# EasyEDA Pro project 机械臂需求板.eprj

# Schematic Schematic1
Create Date: 2025-04-24; Page Name: P1; Project Name: 机械臂需求板; Schematic Name: Schematic1; Update Date: 2025-04-24; Company: 嘉立创EDA; Page Size: A4; Version: V1.0
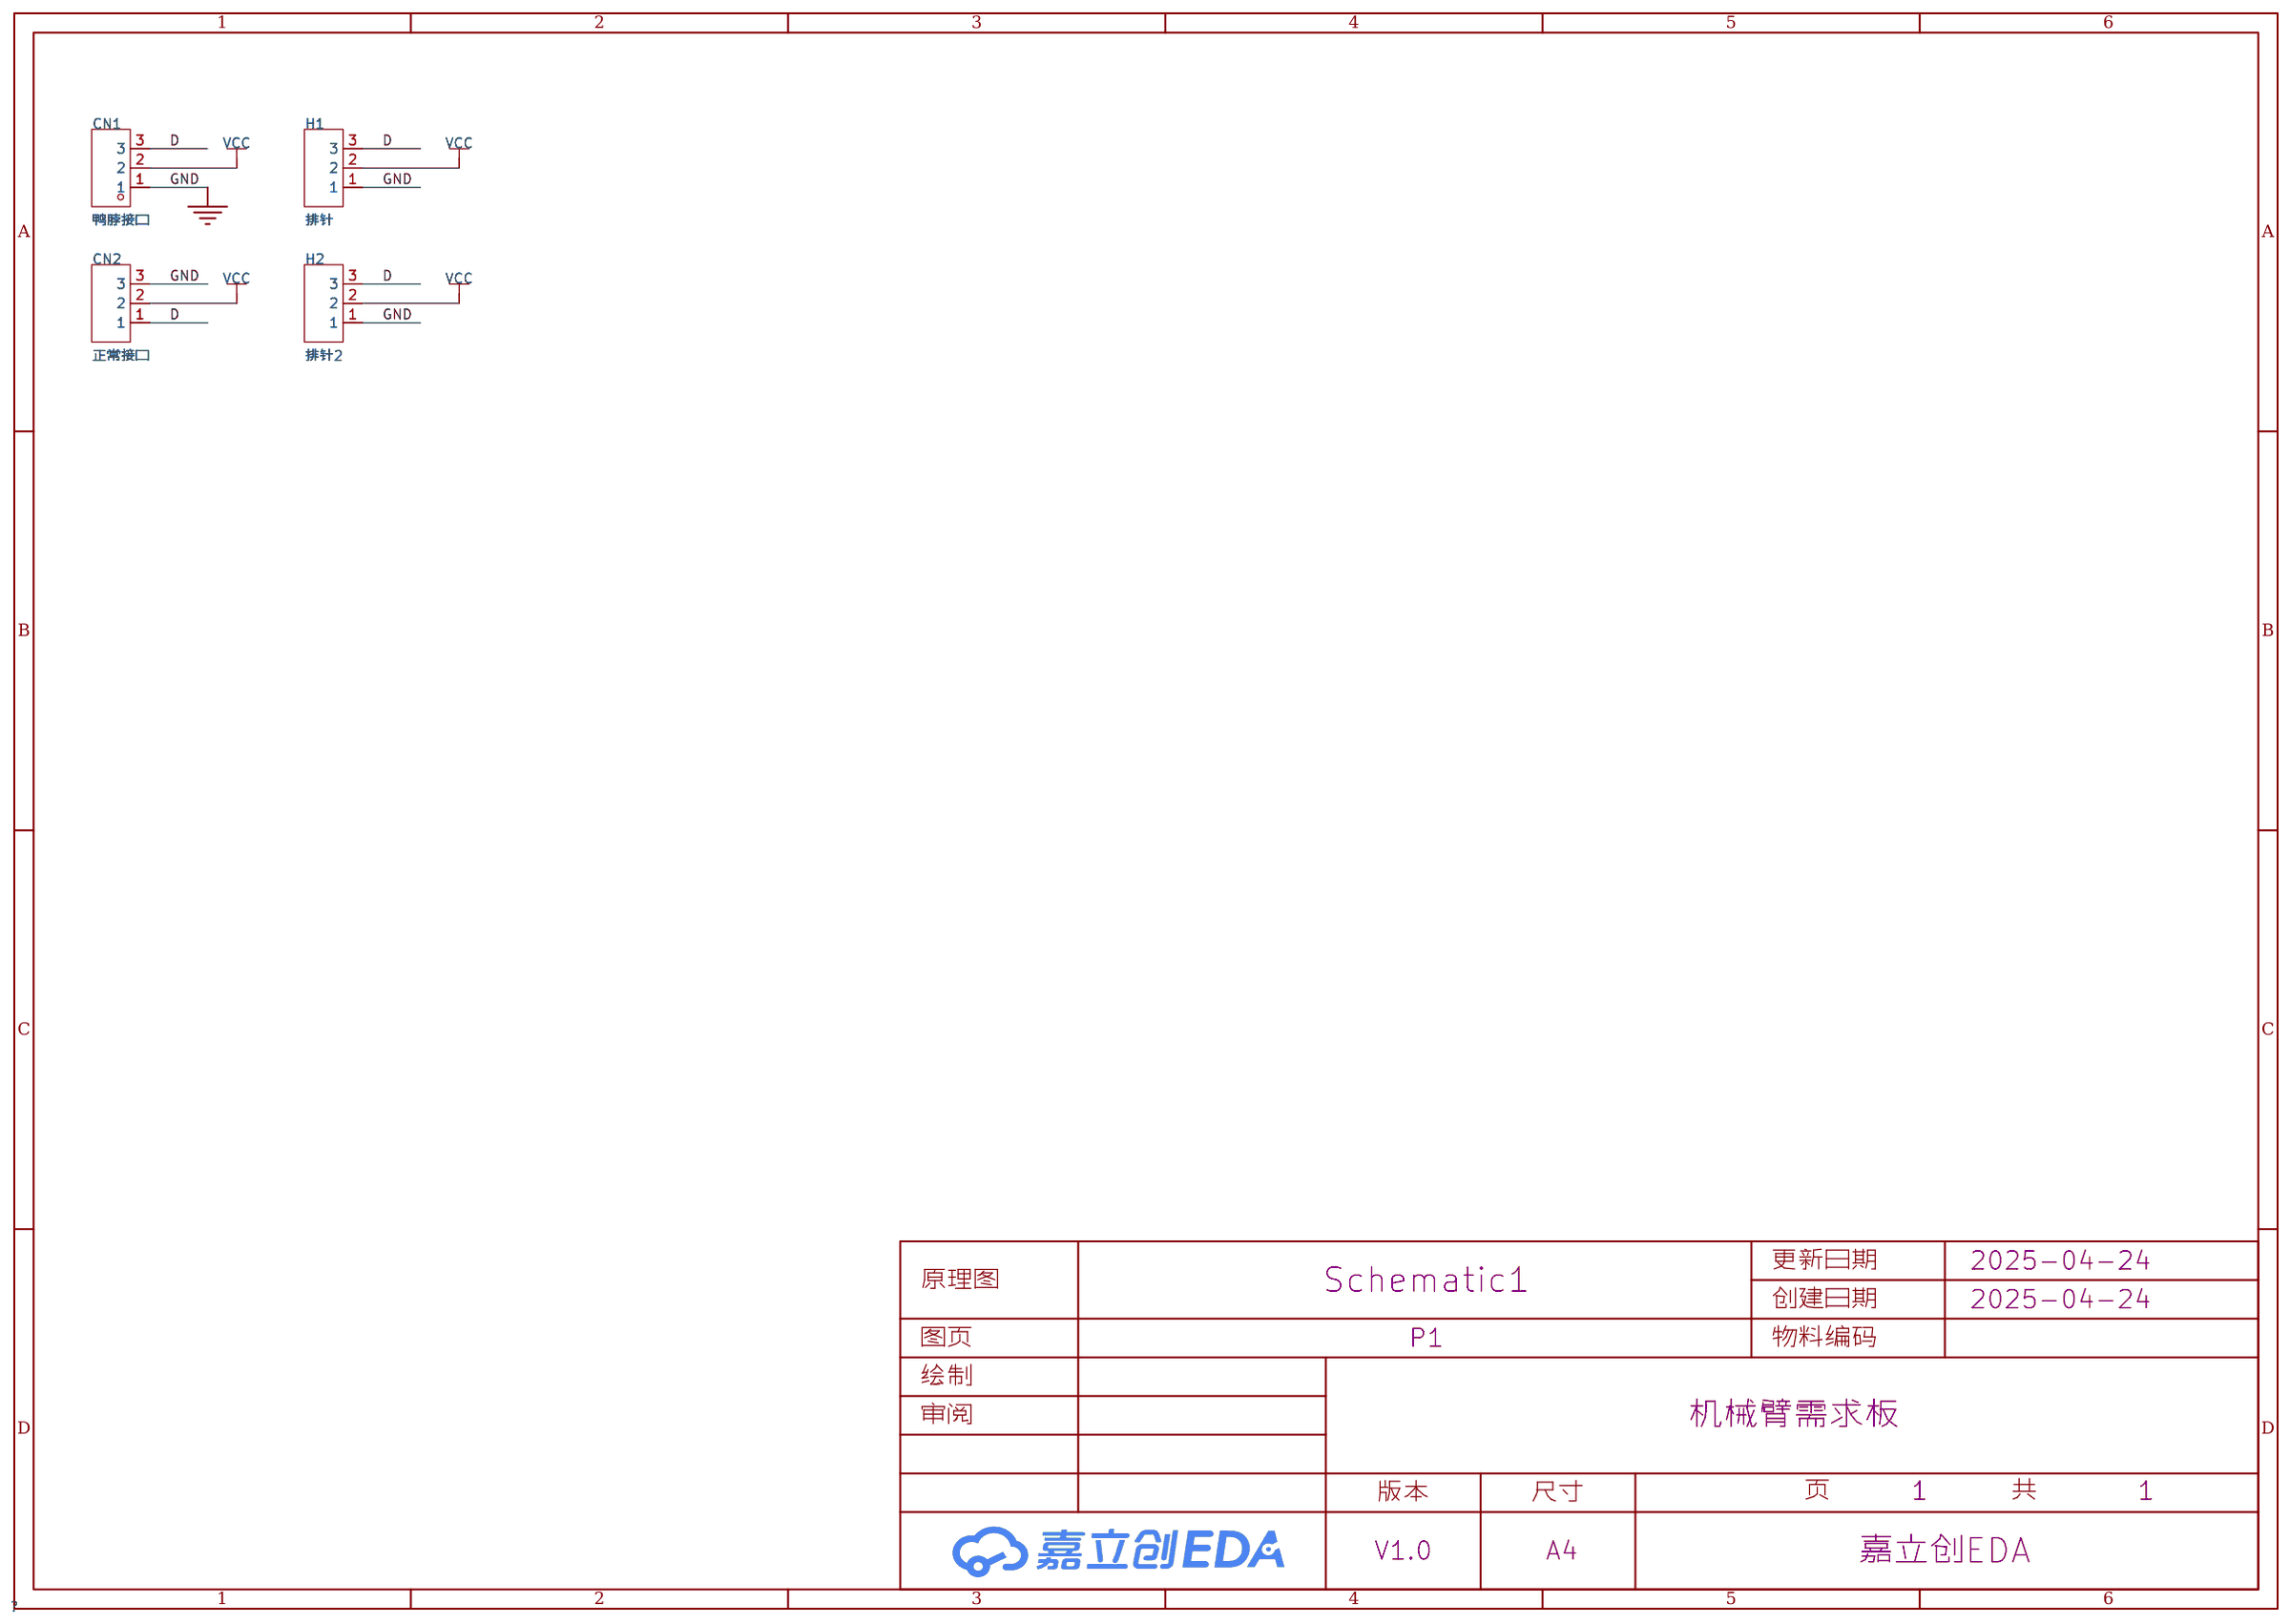
[diagram p0: schematic sheet]

## Parts
CN1  鸭脖接口  [CONN-TH_PH2.0D-L-3P]
CN2  正常接口  [CONN-TH_5264-3A]
H1  排针  [HDR-TH_3P-P2.54-V-M]
H2  排针2  [HDR-TH_3P-P2.54-V-M]

## Library data of the parts
CN1 = WAFER-PH2.0-3PZZ: 插针结构:1x3P;间距:2mm;安装方式:直插;参考系列:PH;总PIN数:3P;排数:1;每排PIN数:3;行距:-;额定电流:2A;触头材质:黄铜;触头镀层:锡;工作温度:-25℃~+85℃;; LCSC Part Name: 1x3P 间距:2mm 直插 系列:PH; Supplier Part: C5359600; Manufacturer: XUNPU(讯普); Supplier Footprint: 插件,P=2mm; JLCPCB Part Class: 扩展库; Datasheet: https://atta.szlcsc.com/upload/public/pdf/source/20241108/09B74E94153224768C62B7F095CB8C18.pdf; Supplier: LCSC; Pins Structure: 1x3P; Pitch: 2mm; Mounting Type: 直插; Reference Series: PH; Number of Pins: 3P; Number of Rows: 1; Number of PINs Per Row: 3; Current Rating: 2A; Contact Material: 黄铜; Contact Plating: 锡; Operating Temperature: -25℃~+85℃; Voltage Rating: 250V; Plastic Material: PA66; Flame Retardant Rating: UL94V-0; Color: 白色; Z-Height of the Board: 6.05mm; X-Length of Bottom Edge on Board (Spacing Line): 8mm; Y-Width of Bottom Edge on Board: 4.7mm
CN2 = 5264-3A: 插针结构:1x3P;间距:2.5mm;安装方式:直插;参考系列:Mini-SPOX(5264);总PIN数:3P;排数:1;每排PIN数:3;行距:-;额定电流:-;触头材质:-;触头镀层:-;工作温度:-;; LCSC Part Name: 1x3P 间距:2.5mm 直插 系列:Mini-SPOX(5264); Supplier Part: C146133; Manufacturer: BOOMELE(博穆精密); Supplier Footprint: 插件,P=2.5mm; JLCPCB Part Class: 扩展库; Supplier: LCSC; Pins Structure: 1x3P; Pitch: 2.5mm; Mounting Type: 直插; Reference Series: Mini-SPOX(5264); Number of Pins: 3P; Number of Rows: 1; Number of PINs Per Row: 3
H1 H2 = PZ254V-11-03P: 插针结构:1x3P;间距:2.54mm;行距:-;圆针/方针:方针;安装方式:直插;排数:单排;总PIN位数:3P;额定电流:3A;额定电压:250V;配合针长度:6mm;塑高:2.5mm;端接针长度:3mm;工作温度:-40℃~+105℃;颜色:黑色;; LCSC Part Name: 1x3P 间距:2.54mm 方针 直插; Supplier Part: C2937625; Manufacturer: XFCN(兴飞); Supplier Footprint: 插件,P=2.54mm; JLCPCB Part Class: 扩展库; Datasheet: https://atta.szlcsc.com/upload/public/pdf/source/20200309/C492402_8335C3D49C4E4C618838D59BB1D024C1.pdf; Supplier: LCSC; Pin Structure: 1x3P; Pitch: 2.54mm; Circluar Pins/Square Pins: 方针; Mounting Type: 直插; Number of Rows: 单排; Number of Pins: 3P; Current Rating: 3A; Voltage Rating (Max): 250V; Length of Mating Pin: 6mm; Insulation Height: 2.5mm; Length of End Connection Pin: 3mm; Operating Temperature: -40℃~+105℃; Color: 黑色

## Nets
GND: CN1.1 CN2.3 H1.1 H2.1
VCC: CN1.2 CN2.2 H1.2 H2.2
D: CN1.3 CN2.1 H1.3 H2.3

# Schematic Schematic2
Create Date: 2025-04-27; Page Name: P1; Project Name: 舵机接口转接板; Schematic Name: Schematic2; Update Date: 2025-04-27; Company: 嘉立创EDA; Page Size: A4; Version: V1.0
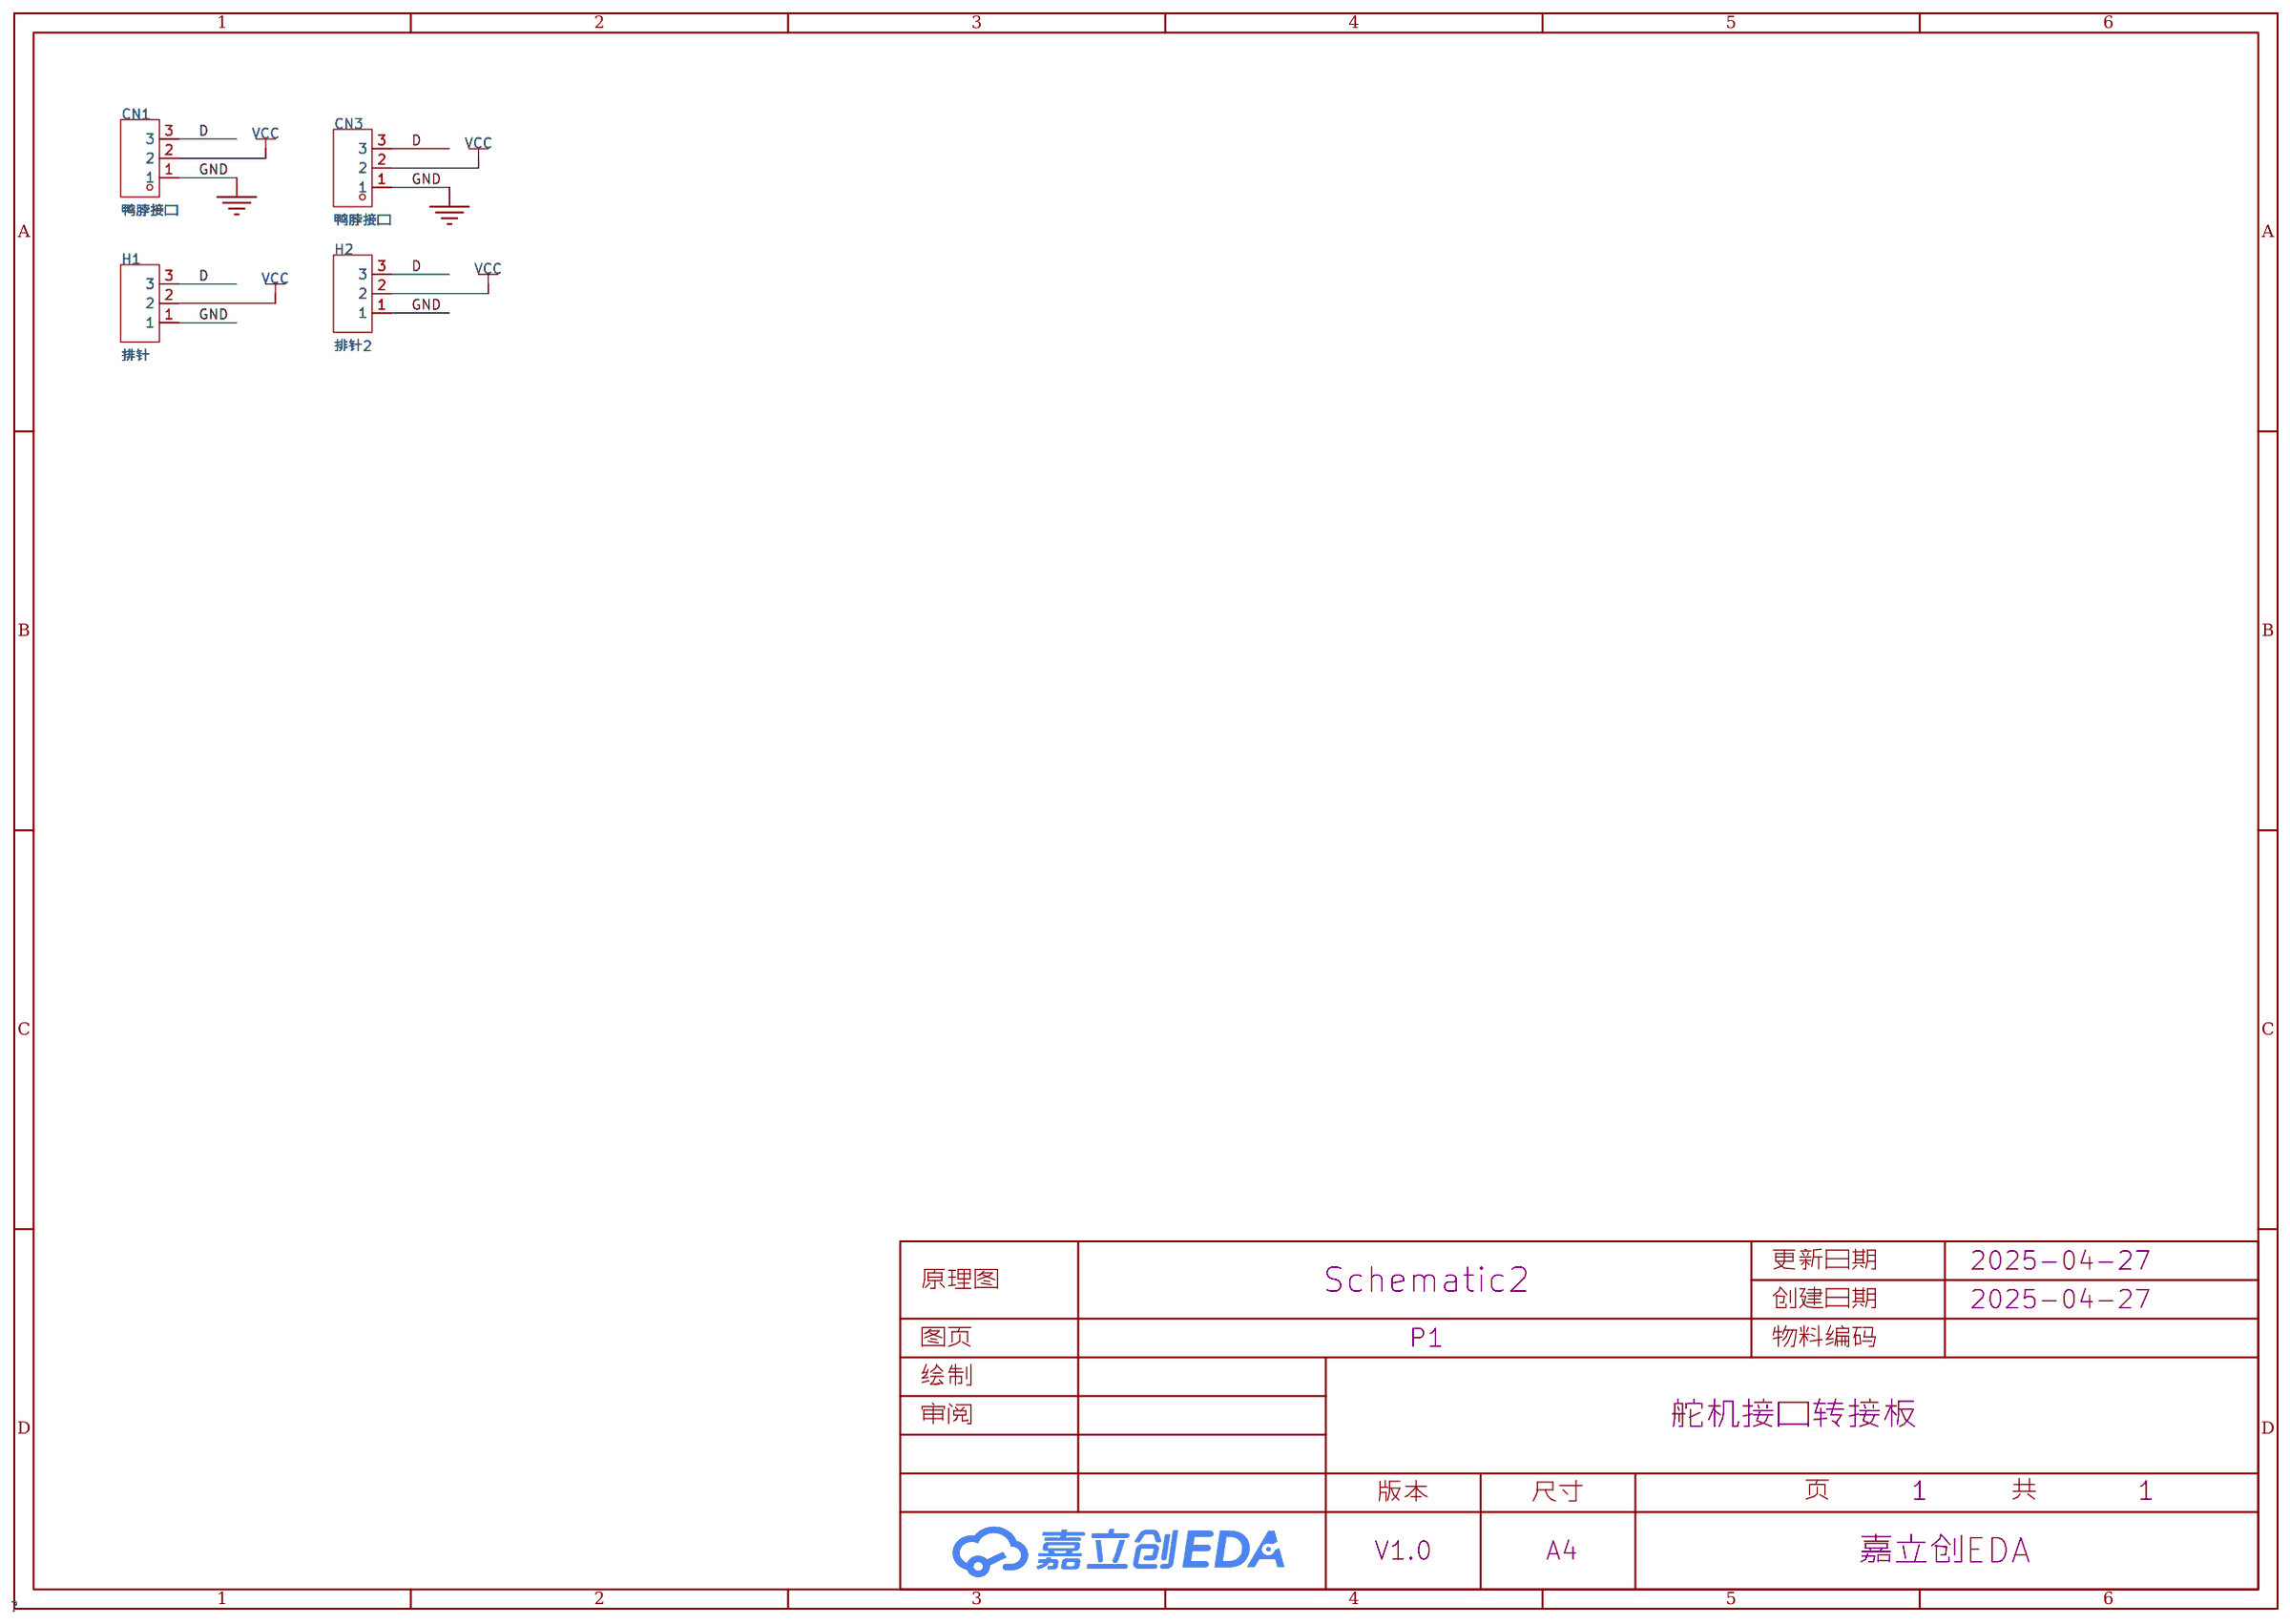
[diagram p1: schematic sheet]

## Parts
CN1  鸭脖接口  [CONN-TH_PH2.0D-L-3P]
CN3  鸭脖接口  [CONN-TH_PH2.0D-L-3P]
H1  排针  [HDR-TH_3P-P2.54-V-M]
H2  排针2  [HDR-TH_3P-P2.54-V-M]

## Library data of the parts
CN1 CN3 = WAFER-PH2.0-3PZZ: 插针结构:1x3P;间距:2mm;安装方式:直插;参考系列:PH;总PIN数:3P;排数:1;每排PIN数:3;行距:-;额定电流:2A;触头材质:黄铜;触头镀层:锡;工作温度:-25℃~+85℃;; LCSC Part Name: 1x3P 间距:2mm 直插 系列:PH; Supplier Part: C5359600; Manufacturer: XUNPU(讯普); Supplier Footprint: 插件,P=2mm; JLCPCB Part Class: 扩展库; Datasheet: https://atta.szlcsc.com/upload/public/pdf/source/20241108/09B74E94153224768C62B7F095CB8C18.pdf; Supplier: LCSC; Pins Structure: 1x3P; Pitch: 2mm; Mounting Type: 直插; Reference Series: PH; Number of Pins: 3P; Number of Rows: 1; Number of PINs Per Row: 3; Current Rating: 2A; Contact Material: 黄铜; Contact Plating: 锡; Operating Temperature: -25℃~+85℃; Voltage Rating: 250V; Plastic Material: PA66; Flame Retardant Rating: UL94V-0; Color: 白色; Z-Height of the Board: 6.05mm; X-Length of Bottom Edge on Board (Spacing Line): 8mm; Y-Width of Bottom Edge on Board: 4.7mm
H1 H2 = PZ254V-11-03P: 插针结构:1x3P;间距:2.54mm;行距:-;圆针/方针:方针;安装方式:直插;排数:单排;总PIN位数:3P;额定电流:3A;额定电压:250V;配合针长度:6mm;塑高:2.5mm;端接针长度:3mm;工作温度:-40℃~+105℃;颜色:黑色;; LCSC Part Name: 1x3P 间距:2.54mm 方针 直插; Supplier Part: C2937625; Manufacturer: XFCN(兴飞); Supplier Footprint: 插件,P=2.54mm; JLCPCB Part Class: 扩展库; Datasheet: https://atta.szlcsc.com/upload/public/pdf/source/20200309/C492402_8335C3D49C4E4C618838D59BB1D024C1.pdf; Supplier: LCSC; Pin Structure: 1x3P; Pitch: 2.54mm; Circluar Pins/Square Pins: 方针; Mounting Type: 直插; Number of Rows: 单排; Number of Pins: 3P; Current Rating: 3A; Voltage Rating (Max): 250V; Length of Mating Pin: 6mm; Insulation Height: 2.5mm; Length of End Connection Pin: 3mm; Operating Temperature: -40℃~+105℃; Color: 黑色

## Nets
GND: CN1.1 CN3.1 H1.1 H2.1
VCC: CN1.2 CN3.2 H1.2 H2.2
D: CN1.3 CN3.3 H1.3 H2.3

# Board PCB1
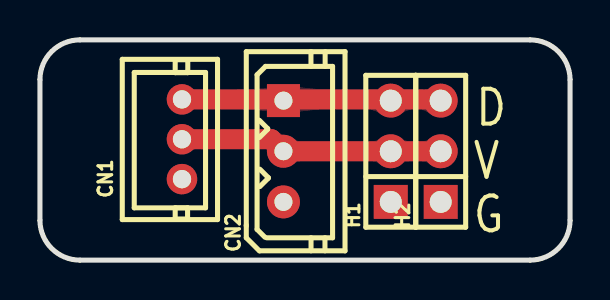
[diagram p2: board, top side]
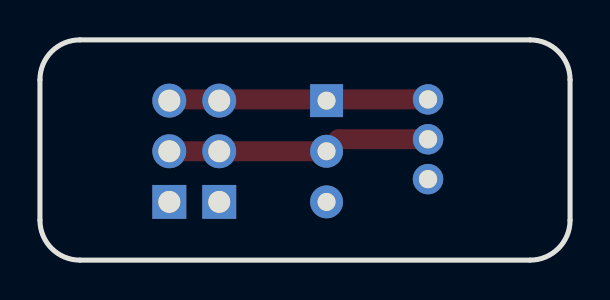
[diagram p3: board, bottom side, seen from below]

Outline 26.54 x 11.05 mm; copper layers: Top Layer, Bottom Layer. Coordinates in mm from the lower left corner of the outline.
Outline path: 0,9.05 0,2 arc(0.59,0.59) 2,0 24.54,0 arc(25.96,0.59) 26.54,2 26.54,9.05 arc(25.96,10.46) 24.54,11.05 2,11.05 arc(0.59,10.46) 0,9.05
Stack: Top Layer 0.035mm / Dielectric1 1.51mm FR4 er 4.5 / Bottom Layer 0.035mm

## Design rules (mm)
template: 自定义配置
spacing copperThickness1oz (default): track to track 0.102, other pairs 0.152 to 0.3
spacing copperThickness2oz: track to track 0.203, other pairs 0.152 to 0.3
track width copperThickness1oz (default): min 0.127, default 0.254, max 2.54
track width copperThickness2oz: min 0.203, default 0.254, max 2.54
differential pair differentialPair (default): width min 0.127, default 0.254, max 2.54; gap min 0.152, default 0.152
via viaSize (default): diameter min 0.5, default 0.61, max 10; hole min 0.3, default 0.305, max 6.3

## Placement (name value [footprint] x y rotation side)
CN1  鸭脖接口  [CONN-TH_PH2.0D-L-3P]  7.11 6.06 90 top
CN2  正常接口  [CONN-TH_5264-3A]  12.19 5.46 90 top
H1  排针  [HDR-TH_3P-P2.54-V-M]  17.57 5.46 90 top
H2  排针2  [HDR-TH_3P-P2.54-V-M]  20.07 5.46 90 top

## Footprints (pads in the part's own frame, mm; a bottom-side part is the same pattern mirrored in y, then rotated)
CONN-TH_5264-3A
  rect 1.65x1.65 hole 0.9: 1(2.54,0)
  round 1.65 hole 0.9: 2(0,0) 3(-2.54,0)
CONN-TH_PH2.0D-L-3P
  round 1.524 hole 0.914: 1(-2,0) 2(0,0) 3(2,0)
HDR-TH_3P-P2.54-V-M
  rect 1.7x1.7 hole 1.1: 1(-2.54,0)
  round 1.7 hole 1.1: 2(0,0) 3(2.54,0)

## Nets
As in the schematic.

## Routing (per net, layer and track width the routed paths; a pad name or vN(x,y) marks a point on that pad's centre or on a via; arc(x,y) is an arc through that point)
VCC: length 13.2
  Top Layer w1: CN1.2 11.59,6.06 CN2.2 H1.2 H2.2
D: length 13
  Top Layer w1: H2.3 20,8.06 CN1.3

## Copper pours and planes (outline as drawn; the poured copper is in the pictures)
GND on Top Layer: -0.38,11.56 26.67,11.56 26.67,-0.51 -0.38,-0.51
GND on Bottom Layer: -0.38,11.56 26.67,11.56 26.67,-0.51 -0.38,-0.51

Small or netless copper shapes (teardrops, artwork), in the pictures only: 17 on Top Layer

## Text on the board
Top Silkscreen Layer: V | G | D

# Board PCB2
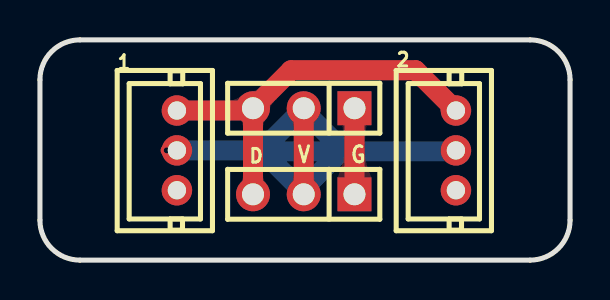
[diagram p4: board, top side]
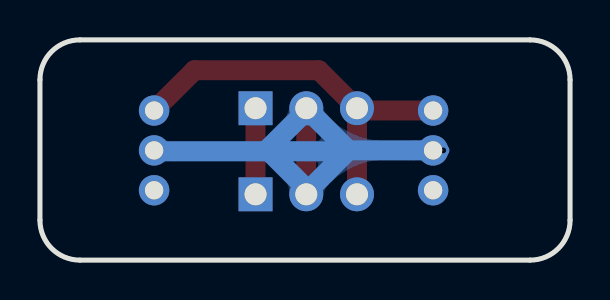
[diagram p5: board, bottom side, seen from below]

Outline 26.54 x 11.05 mm; copper layers: Top Layer, Inner9, Inner10, Inner11, Inner12, Inner13, Inner14, Inner15, Inner16, Inner17, Inner18, Inner19, Inner20, Inner21, Inner22, Inner23, Inner24, Inner25, Inner26, Inner27, Inner28, Inner29, Inner30, Bottom Layer. Coordinates in mm from the lower left corner of the outline.
Outline path: 0,9.05 0,2 arc(0.59,0.59) 2,0 24.54,0 arc(25.96,0.59) 26.54,2 26.54,9.05 arc(25.96,10.46) 24.54,11.05 2,11.05 arc(0.59,10.46) 0,9.05
Stack: Top Layer 0.035mm / Dielectric1 1.51mm FR4 er 4.5 / Bottom Layer 0.035mm

## Design rules (mm)
template: JLCPCB Capability(Two Layers Board)
spacing copperThickness1oz (default): track to track 0.102, other pairs 0.152 to 0.3
spacing copperThickness2oz: track to track 0.203, other pairs 0.152 to 0.3
track width copperThickness1oz (default): min 0.127, default 0.254, max 2.54
track width copperThickness2oz: min 0.203, default 0.254, max 2.54
differential pair differentialPair (default): width min 0.127, default 0.254, max 2.54; gap min 0.152, default 0.152
via viaSize (default): diameter min 0.5, default 0.61, max 10; hole min 0.3, default 0.305, max 6.3

## Placement (name value [footprint] x y rotation side)
1  鸭脖接口  [CONN-TH_PH2.0D-L-3P]  6.86 5.5 90 top
2  鸭脖接口  [CONN-TH_PH2.0D-L-3P]  20.83 5.5 90 top
D  排针2  [HDR-TH_3P-P2.54-V-M]  13.21 7.62 180 top
H1  排针  [HDR-TH_3P-P2.54-V-M]  13.21 3.3 180 top

## Footprints (pads in the part's own frame, mm; a bottom-side part is the same pattern mirrored in y, then rotated)
CONN-TH_PH2.0D-L-3P
  round 1.524 hole 0.914: 1(-2,0) 2(0,0) 3(2,0)
HDR-TH_3P-P2.54-V-M
  rect 1.7x1.7 hole 1.1: 1(-2.54,0)
  round 1.7 hole 1.1: 2(0,0) 3(2.54,0)

## Nets
GND: 1.1 2.1 D.1 H1.1
VCC: 1.2 2.2 D.2 H1.2
D: 1.3 2.3 D.3 H1.3

## Via types
v1: diameter 0.61, hole 0.305, Top Layer to Bottom Layer, 1 via

## Routing (per net, layer and track width the routed paths; a pad name or vN(x,y) marks a point on that pad's centre or on a via; arc(x,y) is an arc through that point)
GND: length 4.6
  Top Layer w1: 15.75,7.87 H1.1
VCC: length 30.1
  Top Layer w1: 13.21,7.87 H1.2
  Bottom Layer w1: 13.21,3.39 13.21,3.59 15.08,5.46 ; 13.21,3.39 11.09,5.5 ; 13.21,3.39 H1.2 ; 11.09,5.5 D.2 13.21,7.49 15.08,5.62 15.08,5.46 ; 11.09,5.5 1.2 ; 15.08,5.46 11.43,5.46 ; 15.08,5.46 20.78,5.46 2.2
  vias: v1(6.35,5.5)
D: length 20
  Top Layer w1: 1.3 10.55,7.5 D.3 ; 2.3 18.81,9.53 12.57,9.53 D.3 ; D.3 H1.3

## Copper pours and planes (outline as drawn; the poured copper is in the pictures)
GND on Top Layer: -0.63,12.19 27.05,12.19 27.05,-0.51 -0.63,-0.51
GND on Bottom Layer: -0.63,12.19 27.05,12.19 27.05,-0.51 -0.63,-0.51

Small or netless copper shapes (teardrops, artwork), in the pictures only: 10 on Top Layer, 7 on Bottom Layer

## Text on the board
Top Silkscreen Layer: V | G
